# Altium schematic sheet AHD Ethernet.SchDoc: Ethernet Section
size B; DrawnBy: Adam Vadala-Roth; DocumentNumber: 5; Revision: 2.4b; SheetNumber: 5; SheetTotal: 9
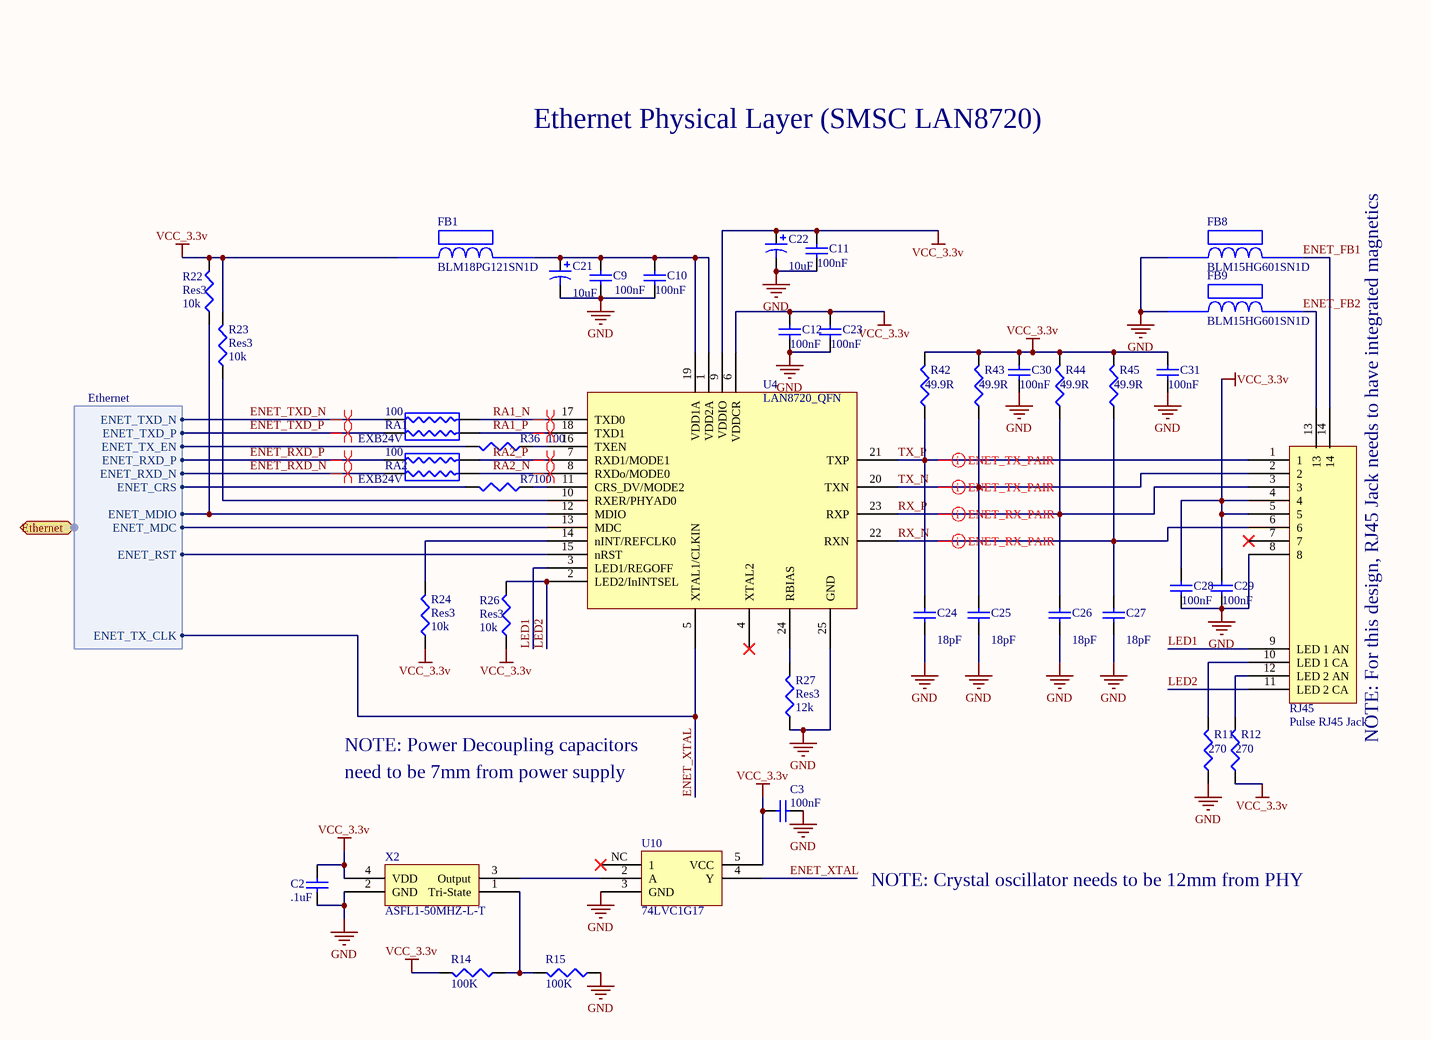
[diagram p0: AHD Ethernet.SchDoc]

## Parts
C2  value .1uF  [1608[0603]]  (hidden comment: Cap Semi)
C3  value 100nF  [1608[0603]]  (hidden comment: Cap Semi)
C9  value 100nF  [1608[0603]]  (hidden comment: Cap Semi)
C10  value 100nF  [1608[0603]]  (hidden comment: Cap Semi)
C11  value 100nF  [1608[0603]]  (hidden comment: Cap Semi)
C12  value 100nF  [1608[0603]]  (hidden comment: Cap Semi)
C21  value 10uF  [CAPC1608L]  (hidden comment: Cap Pol3)
C22  value 10uF  [CAPC1608L]  (hidden comment: Cap Pol3)
C23  value 100nF  [1608[0603]]  (hidden comment: Cap Semi)
C24  value 18pF  [1608[0603]]  (hidden comment: Cap Semi)
C25  value 18pF  [1608[0603]]  (hidden comment: Cap Semi)
C26  value 18pF  [1608[0603]]  (hidden comment: Cap Semi)
C27  value 18pF  [1608[0603]]  (hidden comment: Cap Semi)
C28  value 100nF  [1608[0603]]  (hidden comment: Cap Semi)
C29  value 100nF  [1608[0603]]  (hidden comment: Cap Semi)
C30  value 100nF  [1608[0603]]  (hidden comment: Cap Semi)
C31  value 100nF  [1608[0603]]  (hidden comment: Cap Semi)
FB1  BLM18PG121SN1D  [BLM18PG121SN1D]
FB8  BLM15HG601SN1D  [BLM18PG121SN1D]
FB9  BLM15HG601SN1D  [BLM18PG121SN1D]
R7  value 100  [J1-0603]  (hidden comment: Res3)
R11  value 270  [J1-0603]  (hidden comment: Res3)
R12  value 270  [J1-0603]  (hidden comment: Res3)
R14  value 100K  [J1-0603]  (hidden comment: Res3)
R15  value 100K  [J1-0603]  (hidden comment: Res3)
R22  Res3  value 10k  [J1-0603]
R23  Res3  value 10k  [J1-0603]
R24  Res3  value 10k  [J1-0603]
R26  Res3  value 10k  [J1-0603]
R27  Res3  value 12k  [J1-0603]
R36  value 100  [J1-0603]  (hidden comment: Res3)
R42  value 49.9R  [J1-0603]  (hidden comment: Res3)
R43  value 49.9R  [J1-0603]  (hidden comment: Res3)
R44  value 49.9R  [J1-0603]  (hidden comment: Res3)
R45  value 49.9R  [J1-0603]  (hidden comment: Res3)
RA1  EXB24V  value 100  [EXB24V - Res Array x2]
RA2  EXB24V  value 100  [EXB24V - Res Array x2]
RJ45  Pulse RJ45 Jack  [J0006D21BNL]
U4  LAN8720_QFN  [LAN8720_QFN]
U10  74LVC1G17  [74LVC1G17]
X2  ASFL1-50MHZ-L-T  [ASFL1-50MHZ-L-T]

## Ports
Ethernet (harness Ethernet)

## Harnesses
Ethernet: ENET_RXD_P, ENET_TX_EN, ENET_RST, ENET_TXD_P, ENET_MDC, ENET_RXD_N, ENET_CRS, ENET_MDIO, ENET_TXD_N, ENET_TX_CLK

## Nets
GND: C2.1 C3.1 C9.1 C10.1 C11.1 C12.1 C21.2 C22.2 C23.1 C24.1 C25.1 C26.1 C27.1 C28.1 C29.1 C30.1 C31.1 FB8.1 FB9.1 R11.1 R15.1 R27.1 RJ45.8 U4.25(GND) U10.3(GND) X2.2(GND)
VCC_3.3v: C2.2 C3.2 C11.2 C12.2 C22.1 C23.2 C28.2 C29.2 C30.2 C31.2 FB1.1 R12.1 R14.2 R22.2 R23.2 R24.1 R26.1 R42.2 R43.2 R44.2 R45.2 RJ45.4 RJ45.5 U4.6(VDDCR) U4.9(VDDIO) U10.5(VCC) X2.4(VDD)
ENET_FB1: FB8.2 RJ45.14
ENET_FB2: FB9.2 RJ45.13
ENET_RXD_N: RA2.1 ; port Ethernet.ENET_RXD_N
ENET_RXD_P: RA2.3 ; port Ethernet.ENET_RXD_P
ENET_TXD_N: RA1.3 ; port Ethernet.ENET_TXD_N
ENET_TXD_P: RA1.1 ; port Ethernet.ENET_TXD_P
ENET_XTAL: U4.5(XTAL1/CLKIN) U10.4(Y) ; port Ethernet.ENET_TX_CLK
LED1: RJ45.9(LED_1_AN) U4.3(LED1/REGOFF)
LED2: R26.2 RJ45.11(LED_2_CA) U4.2(LED2/InINTSEL)
RA1_N: RA1.4 U4.17(TXD0)
RA1_P: RA1.2 U4.18(TXD1)
RA2_N: RA2.2 U4.8(RXDo/MODE0)
RA2_P: RA2.4 U4.7(RXD1/MODE1)
RX_N: C27.2 R45.1 RJ45.6 U4.22(RXN)
RX_P: C26.2 R44.1 RJ45.3 U4.23(RXP)
TX_N: C25.2 R43.1 RJ45.2 U4.20(TXN)
TX_P: C24.2 R42.1 RJ45.1 U4.21(TXP)
NetC9_2: C9.2 C10.2 C21.1 FB1.2 U4.1(VDD2A) U4.19(VDD1A)
NetR7_1: R7.1 U4.11(CRS_DV/MODE2)
NetR7_2: R7.2 ; port Ethernet.ENET_CRS
NetR11_2: R11.2 RJ45.10(LED_1_CA)
NetR12_2: R12.2 RJ45.12(LED_2_AN)
NetR14_1: R14.1 R15.2 X2.1(Tri-State)
NetR22_1: R22.1 U4.12(MDIO) ; port Ethernet.ENET_MDIO
NetR23_1: R23.1 U4.10(RXER/PHYAD0)
NetR24_2: R24.2 U4.14(nINT/REFCLK0)
NetR27_2: R27.2 U4.24(RBIAS)
NetR36_1: R36.1 U4.16(TXEN)
NetR36_2: R36.2 ; port Ethernet.ENET_TX_EN
NetU4_13: U4.13(MDC) ; port Ethernet.ENET_MDC
NetU4_15: U4.15(nRST) ; port Ethernet.ENET_RST
NetU10_2: U10.2(A) X2.3(Output)

Not connected (* = marked no-connect by the designer): RJ45 7*; U4 4(XTAL2)*; U10 NC(1)*

## Layout directives
differential pair: ENET_RXD_N, ENET_RXD_P, ENET_TXD_N, ENET_TXD_P, RA1_N, RA1_P, RA2_N, RA2_P, RX_N, RX_P, TX_N, TX_P

## Notes on the sheet
- Ethernet Physical Layer (SMSC LAN8720)
- (near RJ45) NOTE: For this design, RJ45 Jack needs to have integrated magnetics
- NOTE: Power Decoupling capacitors
- need to be 7mm from power supply
- NOTE: Crystal oscillator needs to be 12mm from PHY

## Library data of the parts
C2 C3 C9-C12 C23-C31 = Cap Semi: Capacitor (Semiconductor SIM Model); Published: 8-Jun-2000; LatestRevisionDate: 29-May-2009; LatestRevisionNote: IPC-7351 Footprint Added.; PackageReference: C1206; Publisher: Altium Limited; PackageDescription: Chip Capacitor
C21 C22 = Cap Pol3: Polarized Capacitor (Surface Mount); Published: 8-Jun-2000; LatestRevisionDate: 29-May-2009; LatestRevisionNote: IPC-7351 Footprint Added.; PackageReference: C0805; Publisher: Altium Limited; PackageDescription: Chip Capacitor
R7 R11 R12 R14 R15 R22-R24 R26 R27 R36 R42-R45 = Res3: Resistor; Published: 8-Jun-2000; LatestRevisionDate: 29-May-2009; LatestRevisionNote: IPC-7351 Footprint Added.; PackageReference: J1-0603; Publisher: Altium Limited; PackageDescription: Chip Resistor
RA1 RA2 = EXB24V - Res Array x2
RJ45 = Pulse RJ45_ICM_LED_Jack
U4 = LAN8720 QFN